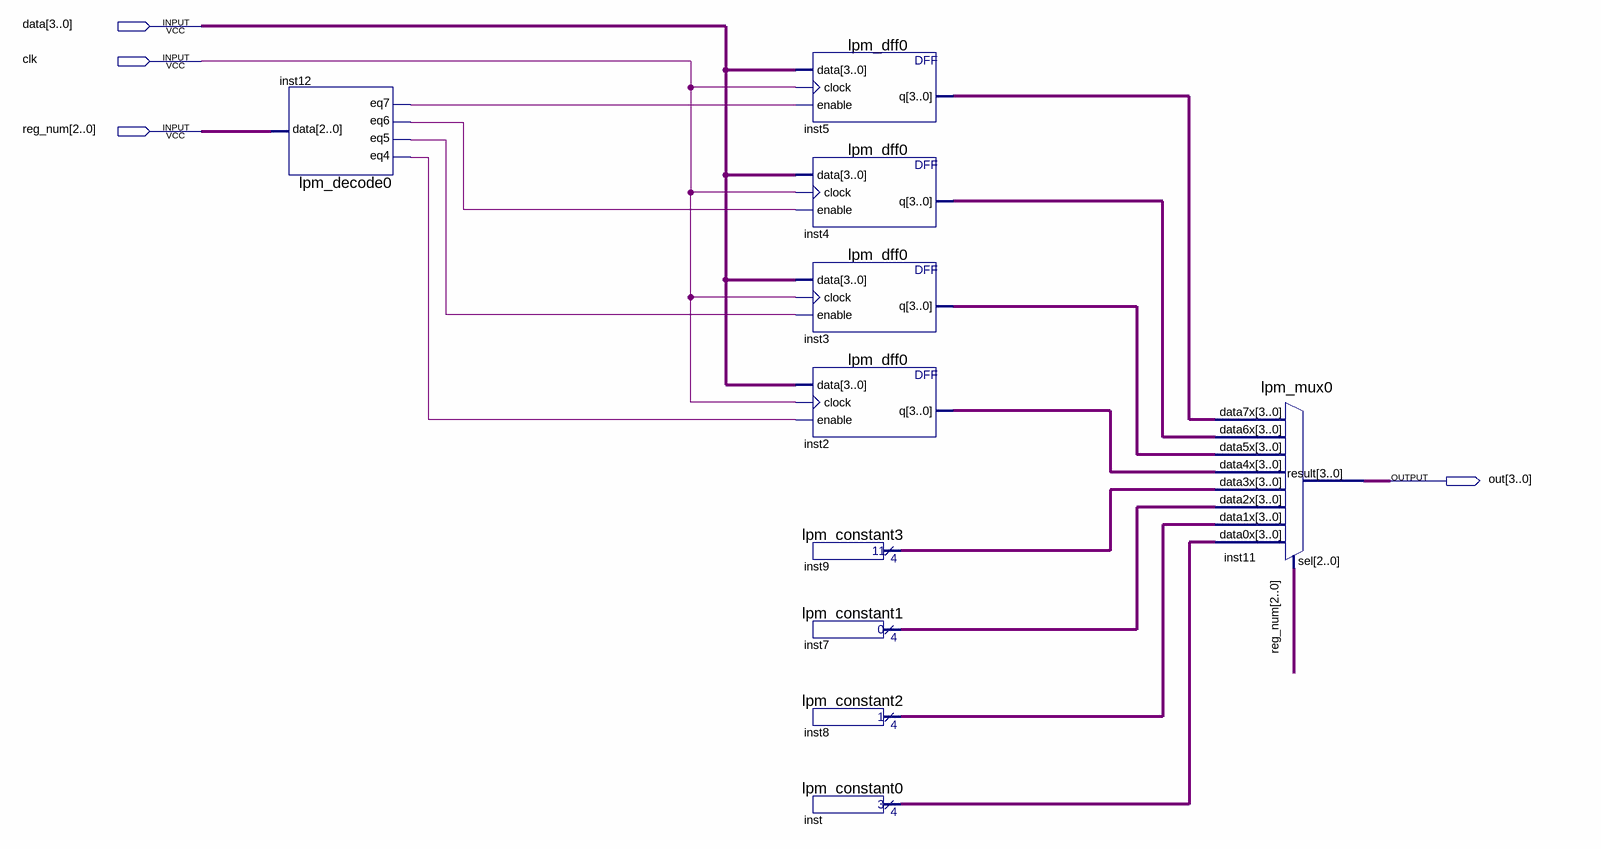
[diagram p0: schematic sheet]
// Quartus schematic REGISTERS.bdf as structural Verilog: 10 symbols, 4 pins
module REGISTERS (
  input  [3:0] data,
  input  clk,
  input  [2:0] reg_num,
  output [3:0] out
);

  wire inst12_eq4, inst12_eq5, inst12_eq6, inst12_eq7;
  wire [3:0] inst2_q, inst3_q, inst4_q, inst5_q, inst7_result, inst8_result, inst9_result, inst_result;

  lpm_decode0 inst12 (.data(reg_num), .eq4(inst12_eq4), .eq5(inst12_eq5), .eq6(inst12_eq6), .eq7(inst12_eq7));
  lpm_dff0 inst5 (.data(data), .clock(clk), .enable(inst12_eq7), .q(inst5_q));
  lpm_dff0 inst4 (.data(data), .clock(clk), .enable(inst12_eq6), .q(inst4_q));
  lpm_dff0 inst3 (.data(data), .clock(clk), .enable(inst12_eq5), .q(inst3_q));
  lpm_dff0 inst2 (.data(data), .clock(clk), .enable(inst12_eq4), .q(inst2_q));
  lpm_constant3 inst9 (.result(inst9_result));
  lpm_constant1 inst7 (.result(inst7_result));
  lpm_constant2 inst8 (.result(inst8_result));
  lpm_constant0 inst (.result(inst_result));
  lpm_mux0 inst11 (
    .data7x(inst5_q), .data6x(inst4_q), .data5x(inst3_q), .data4x(inst2_q), .data3x(inst9_result),
    .data2x(inst7_result), .data1x(inst8_result), .data0x(inst_result), .sel(reg_num), .result(out));
endmodule
